# Altium schematic sheet PAGE1-MAIN.SchDoc
size A3; DocumentNumber: 1; SheetNumber: 1; SheetTotal: 2
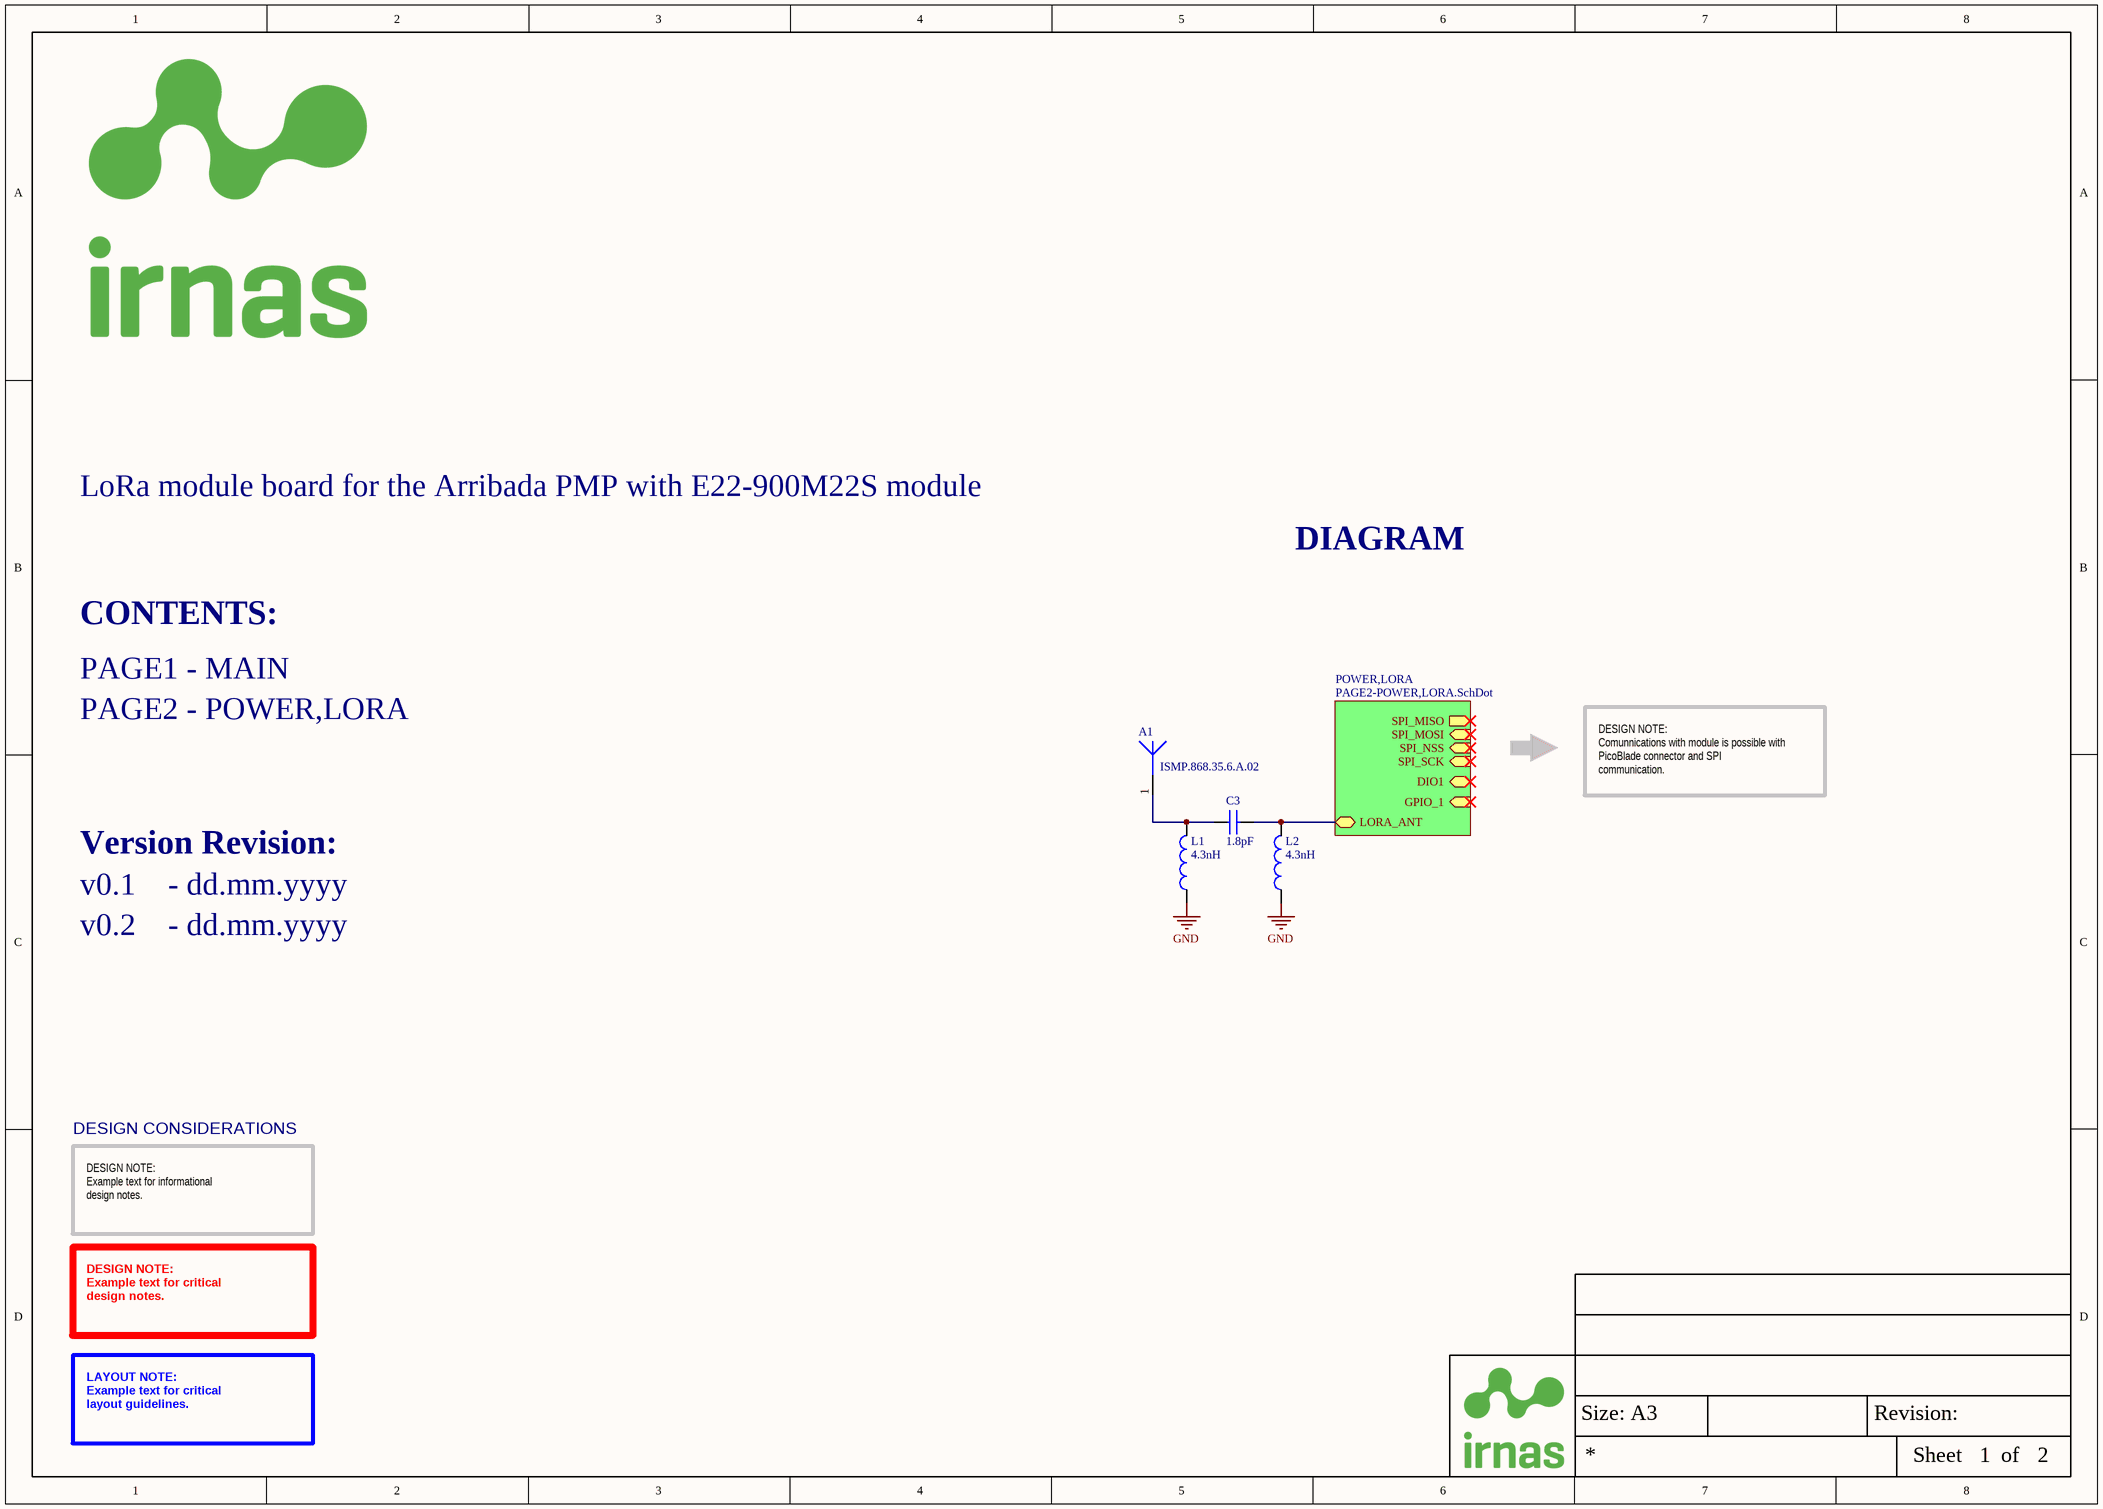
[diagram p0: PAGE1-MAIN.SchDoc]

## Parts
A1  ISMP.868.35.6.A.02  [ISMP.868.35.6.A.02]
C3  1.8pF  [CAP0402]
L1  4.3nH  [IND0402]
L2  4.3nH  [IND0402]

## Sub-sheets
POWER,LORA = PAGE2-POWER,LORA.SchDot: SPI_NSS (in), LORA_ANT (bidir), SPI_MISO (out), SPI_MOSI (in), DIO1 (bidir), SPI_SCK (in), GPIO_1 (in)

## Nets
GND: L1.1 L2.1
NetA1_1: A1.1(ANT) C3.1 L1.2
NetC3_2: C3.2 L2.2 ; sheet POWER,LORA/LORA_ANT

## Notes on the sheet
- LoRa module board for the Arribada PMP with E22-900M22S module
- DIAGRAM
- CONTENTS:
- PAGE1 - MAIN
- PAGE2 - POWER,LORA
- DESIGN NOTE:
  Comunnications with module is possible with PicoBlade connector and SPI communication.
- Version Revision:
- v0.1    - dd.mm.yyyy
- v0.2    - dd.mm.yyyy
- DESIGN CONSIDERATIONS
- DESIGN NOTE:
  Example text for informational
  design notes.
- DESIGN NOTE:
  Example text for critical
  design notes.
- LAYOUT NOTE:
  Example text for critical
  layout guidelines.
- Size: A3
- Revision:
- Sheet
- of

## Library data of the parts
A1 = ANT - ISMP.868.35.6.A.02: Patch Antenna, 868MHz, 2.17dBi Gain, 50ohm, Right Hand Circular Polarisation, Adhesive/Pin; Manufacturer: Antenova; Manufacturer Part Number: SR42I010-R; ComponentLink1Description: Datasheet; ComponentLink1URL: http://www.farnell.com/datasheets/2703591.pdf?_ga=2.254622927.691918385.1573213895-1730437145.1573213895; Supplier Part Number 1: 2949079; Supplier 1: Farnell
C3 = C - 1.8pF/0402: Multilayer Ceramic Capacitors MLCC - SMD/SMT 50volts 1.8pF C0G; Manufacturer: KEMET; Manufacturer Part Number: C0402C189B5GACTU; IRNAS Part No.: /; Voltage Rating: 50V; Supplier 1: Farnell; Stock 1: 8950; Pricing 1: 10=0.463, 100=0.248, 500=0.182, 2500=0.153, 5000=0.134, 10000=0.11, 50000=0.0961 (EUR); Case/Package: 0402; Case Code (Imperial): 0402; Case Code (Metric): 1005; Dielectric Material: Ceramic; Min Operating Temperature: -55°C; Max Operating Temperature: 125°C; Packaging: Tape and Reel; Voltage Rating (DC): 50V; Capacitance: 1.8pF; Termination: SMD/SMT; Lead Free: Lead Free; ComponentLink1URL: https://datasheet.ciiva.com/5413/kem-c1003-c0g-smd-5413366.pdf; ComponentLink1Description: https://datasheet.ciiva.com/5413/kem-c1003-c0g-smd-5413366.pdf; Supplier Part Number 1: 2820847
L1 L2 = L - 4.3nH/0402: Inductor RF Chip Multi-Layer 4.3nH 0.3nH 100MHz 8Q-Factor Air 300mA 210mOhm DCR 0402 Paper T/R; Manufacturer: Murata; Manufacturer Part Number: LQG15HN4N3S02D; IRNAS Part No.: /; Q Factor: 8; Self Resonant Frequency: 6GHz; Shielding: Unshielded; DC Resistance (DCR): 210mR; Supplier 1: Digi-Key; Stock 1: 3502; Pricing 1: 1 = 0.10000, 10 = 0.06100, 100 = 0.04040, 500 = 0.03366, 1000 = 0.02827, 2500 = 0.02423 (USD); RoHS: Yes; Mount: Surface Mount; Case/Package: 0402; Core Material: Air; Case Code (Metric): 1005; Case Code (Imperial): 0402; Min Operating Temperature: -55°C; Max Operating Temperature: 125°C; Package Quantity: 10000; Packaging: Tape and Reel; Current Rating: 300mA; Inductance: 4.3nh; Test Frequency: 100MHz; Max DC Current: 300mA; Termination: SMD/SMT; Current: 300mA; DC Current: 300mA; Military Standard: Not; Length: 1.05mm; Height: 0.5mm; Width: 0.02inch; Height - Seated (Max): 0.022inch; Depth: 0.55mm; Radiation Hardening: No; REACH SVHC: No SVHC; Lead Free: Lead Free; ComponentLink1URL: http://uk.rs-online.com/webdocs/0f10/0900766b80f10808.pdf?src-supplier=RSComponents; ComponentLink1Description: http://uk.rs-online.com/webdocs/0f10/0900766b80f10808.pdf?src-supplier=RSComponents; ComponentLink2URL: http://search.murata.co.jp/Ceramy/image/img/PDF/ENG/L0075S0083LQG15HN.pdf?src-supplier=Avnet; ComponentLink2Description: http://search.murata.co.jp/Ceramy/image/img/PDF/ENG/L0075S0083LQG15HN.pdf?src-supplier=Avnet; ComponentLink3URL: http://www.farnell.com/datasheets/66026.pdf?src-supplier=Element14; ComponentLink3Description: http://www.farnell.com/datasheets/66026.pdf?src-supplier=Element14; ComponentLink4URL: https://www.verical.com/server-webapp/html/getDatasheet?partID=31252&src-supplier=Verical; ComponentLink4Description: https://www.verical.com/server-webapp/html/getDatasheet?partID=31252&src-supplier=Verical; ComponentLink5URL: http://search.murata.co.jp/Ceramy/image/img/PDF/ENG/L0075S0083LQG15HN.pdf?src-supplier=Avnet+Europe; ComponentLink5Description: http://search.murata.co.jp/Ceramy/image/img/PDF/ENG/L0075S0083LQG15HN.pdf?src-supplier=Avnet+Europe; ComponentLink6URL: https://search.murata.co.jp/Ceramy/image/img/P02/partnumberingAT_LQ3E.pdf?src-supplier=Digi-Key; ComponentLink6Description: https://search.murata.co.jp/Ceramy/image/img/P02/partnumberingAT_LQ3E.pdf?src-supplier=Digi-Key; Supplier Part Number 1: 490-6563-1-ND